# Altium schematic sheet MB_ADC.SchDoc
size 420 x 297 mm; Date: 18/12/2022; ApprovedBy: UA3REO; CheckedBy: UA3REO; Author: RU4PN; CompanyName: Wolf Team; DocumentNumber: Wolf2 MainBoard ADC; SheetNumber: 4; SheetTotal: 7
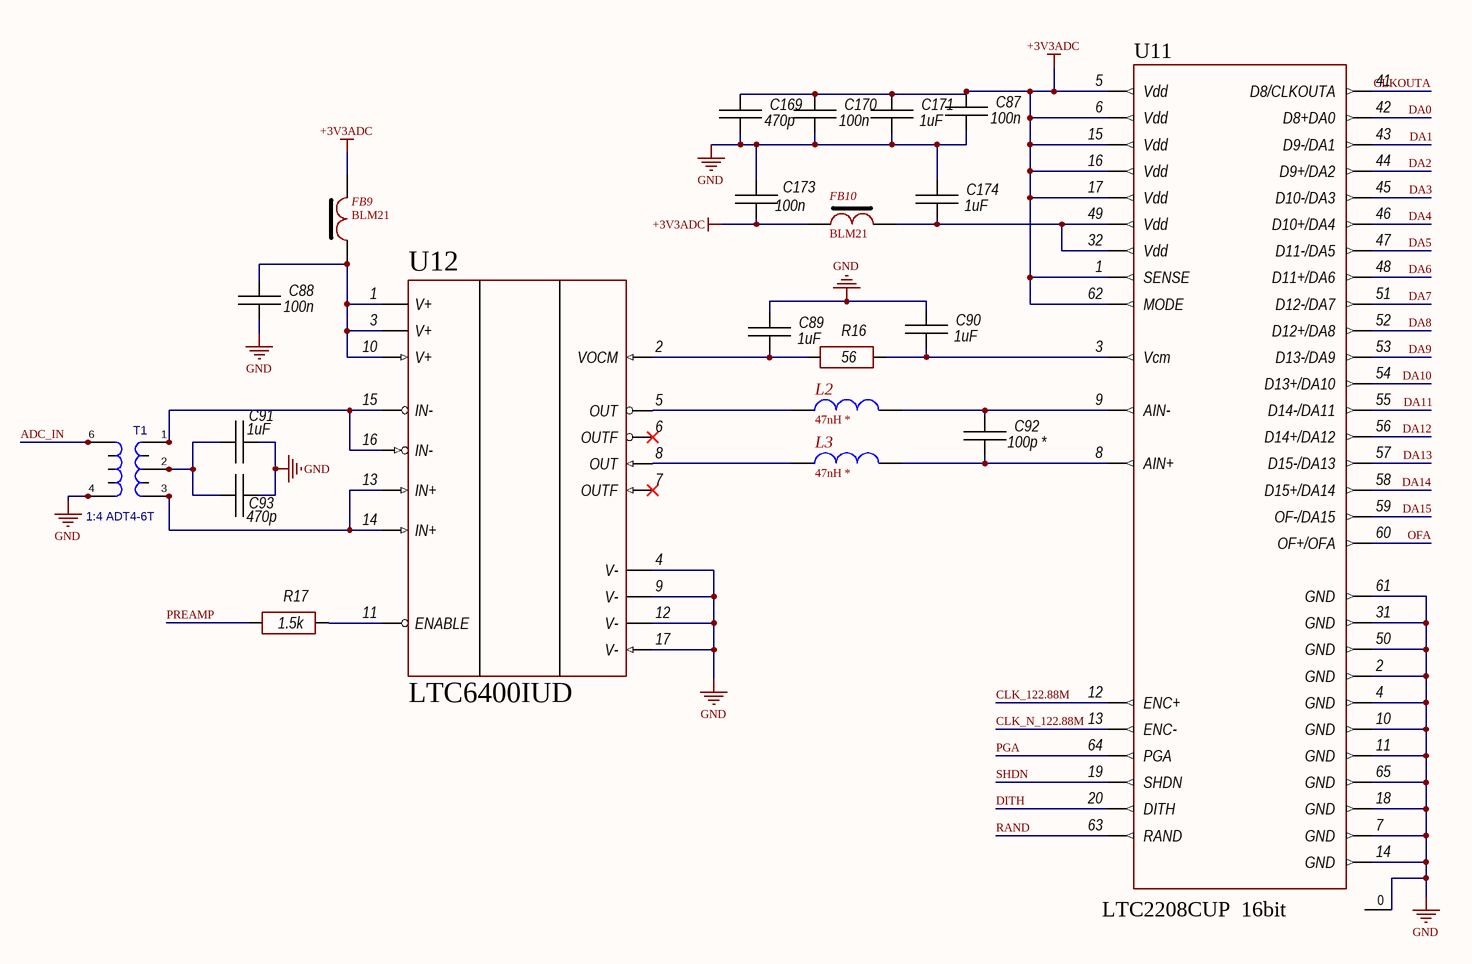
[diagram p0: MB_ADC.SchDoc]

## Parts
C87  100n  [CH0805C]
C88  100n  [CH0805C]
C89  1uF  [CH0805C]
C90  1uF  [CH0805C]
C91  1uF  [CH0805C]
C92  100p *  [CH0805C]
C93  470p  [CH0805C]
C169  470p  [CH0805C]
C170  100n  [CH0805C]
C171  1uF  [CH0805C]
C173  100n  [CH0805C]
C174  1uF  [CH0805C]
FB9  BLM21  [CH0805L]
FB10  BLM21  [CH0805F]
L2  47nH *  [CH1210L]
L3  47nH *  [CH1210L]
R16  56  [CH0805R]
R17  1.5k  [CH0805R]
T1  1:4 ADT4-6T  [TRANSF_ACORE2]
U11  LTC2208CUP  16bit  [64-QFN (9x9)]
U12  LTC6400IUD  [16-QFN 3x3]

## Nets
+3V3ADC: C87.1 C169.1 C170.1 C171.1 C173.2 FB9.1 FB10.2 U11.1(SENSE) U11.5(Vdd) U11.6(Vdd) U11.15(Vdd) U11.16(Vdd) U11.17(Vdd) U11.62(MODE)
GND: C87.2 C88.2 C89.1 C90.1 C91.2 C93.2 C169.2 C170.2 C171.2 C173.1 C174.1 T1.4(P1) T1.11 U11.0 U11.2(GND) U11.4(GND) U11.7(GND) U11.10(GND) U11.11(GND) U11.14(GND) U11.18(GND) U11.31(GND) U11.50(GND) U11.61(GND) U11.65(GND) U12.4(V-) U12.9(V-) U12.12(V-) U12.17(V-)
ADC_IN: T1.6(P2) T1.10
CLK_122.88M: U11.12(ENC+)
CLK_N_122.88M: U11.13(ENC-)
CLKOUTA: U11.41(D8/CLKOUTA)
DA0: U11.42(D8+DA0)
DA1: U11.43(D9-/DA1)
DA2: U11.44(D9+/DA2)
DA3: U11.45(D10-/DA3)
DA4: U11.46(D10+/DA4)
DA5: U11.47(D11-/DA5)
DA6: U11.48(D11+/DA6)
DA7: U11.51(D12-/DA7)
DA8: U11.52(D12+/DA8)
DA9: U11.53(D13-/DA9)
DA10: U11.54(D13+/DA10)
DA11: U11.55(D14-/DA11)
DA12: U11.56(D14+/DA12)
DA13: U11.57(D15-/DA13)
DA14: U11.58(D15+/DA14)
DA15: U11.59(OF-/DA15)
DITH: U11.20(DITH)
OFA: U11.60(OF+/OFA)
PGA: U11.64(PGA)
PREAMP: R17.2
RAND: U11.63(RAND)
SHDN: U11.19(SHDN)
NetC88_1: C88.1 FB9.2 U12.1(V+) U12.3(V+) U12.10(V+)
NetC89_2: C89.2 R16.2 U12.2(VOCM)
NetC90_2: C90.2 R16.1 U11.3(Vcm)
NetC91_1: C91.1 C93.1 T1.2(S2) T1.8
NetC92_1: C92.1 L2.1 U11.9(AIN-)
NetC92_2: C92.2 L3.1 U11.8(AIN+)
NetC174_2: C174.2 FB10.1 U11.32(Vdd) U11.49(Vdd)
NetL2_2: L2.2 U12.5(OUT)
NetL3_2: L3.2 U12.8(OUT)
NetR17_1: R17.1 U12.11(ENABLE)
NetT1_1: T1.1(S3) T1.7 U12.15(IN-) U12.16(IN-)
NetT1_3: T1.3(S1) T1.9 U12.13(IN+) U12.14(IN+)

Not connected (* = marked no-connect by the designer): U12 6(OUTF)* 7(OUTF)*

## Notes on the sheet
- Перв. примен.
- Справ. №
- Подп. и дата
- Инв. № дубл.
- Взам. инв. №
- Разраб.
- Изм.
- Лист
- № докум.
- Подп.
- Дата
- Лит.
- Масса
- Масштаб
- Пров.
- Т.контр.
- Листов
- Инв. № подл.
- Утв.
- Н.контр.
- 2.106-A3
- Копировал
- Формат А3

## Library data of the parts
C87-C93 C169-C171 C173 C174 = Capacitor: Manufacturer: *; Model: *; HelpURL: *; ComponentKind: *; Value: *
FB9 FB10 = FB-1
L2 L3 = Inductor-2
R16 R17 = Resistor: Manufacturer: *; Model: *; HelpURL: *; ComponentKind: *; Value: *
T1 = TRANSF_ACORE2: Transformer; Value: 1:4 ADT4-6T
U11 = LTC2208CUP